# EAGLE design riser-1u-cc2420 (EAGLE 5.09)
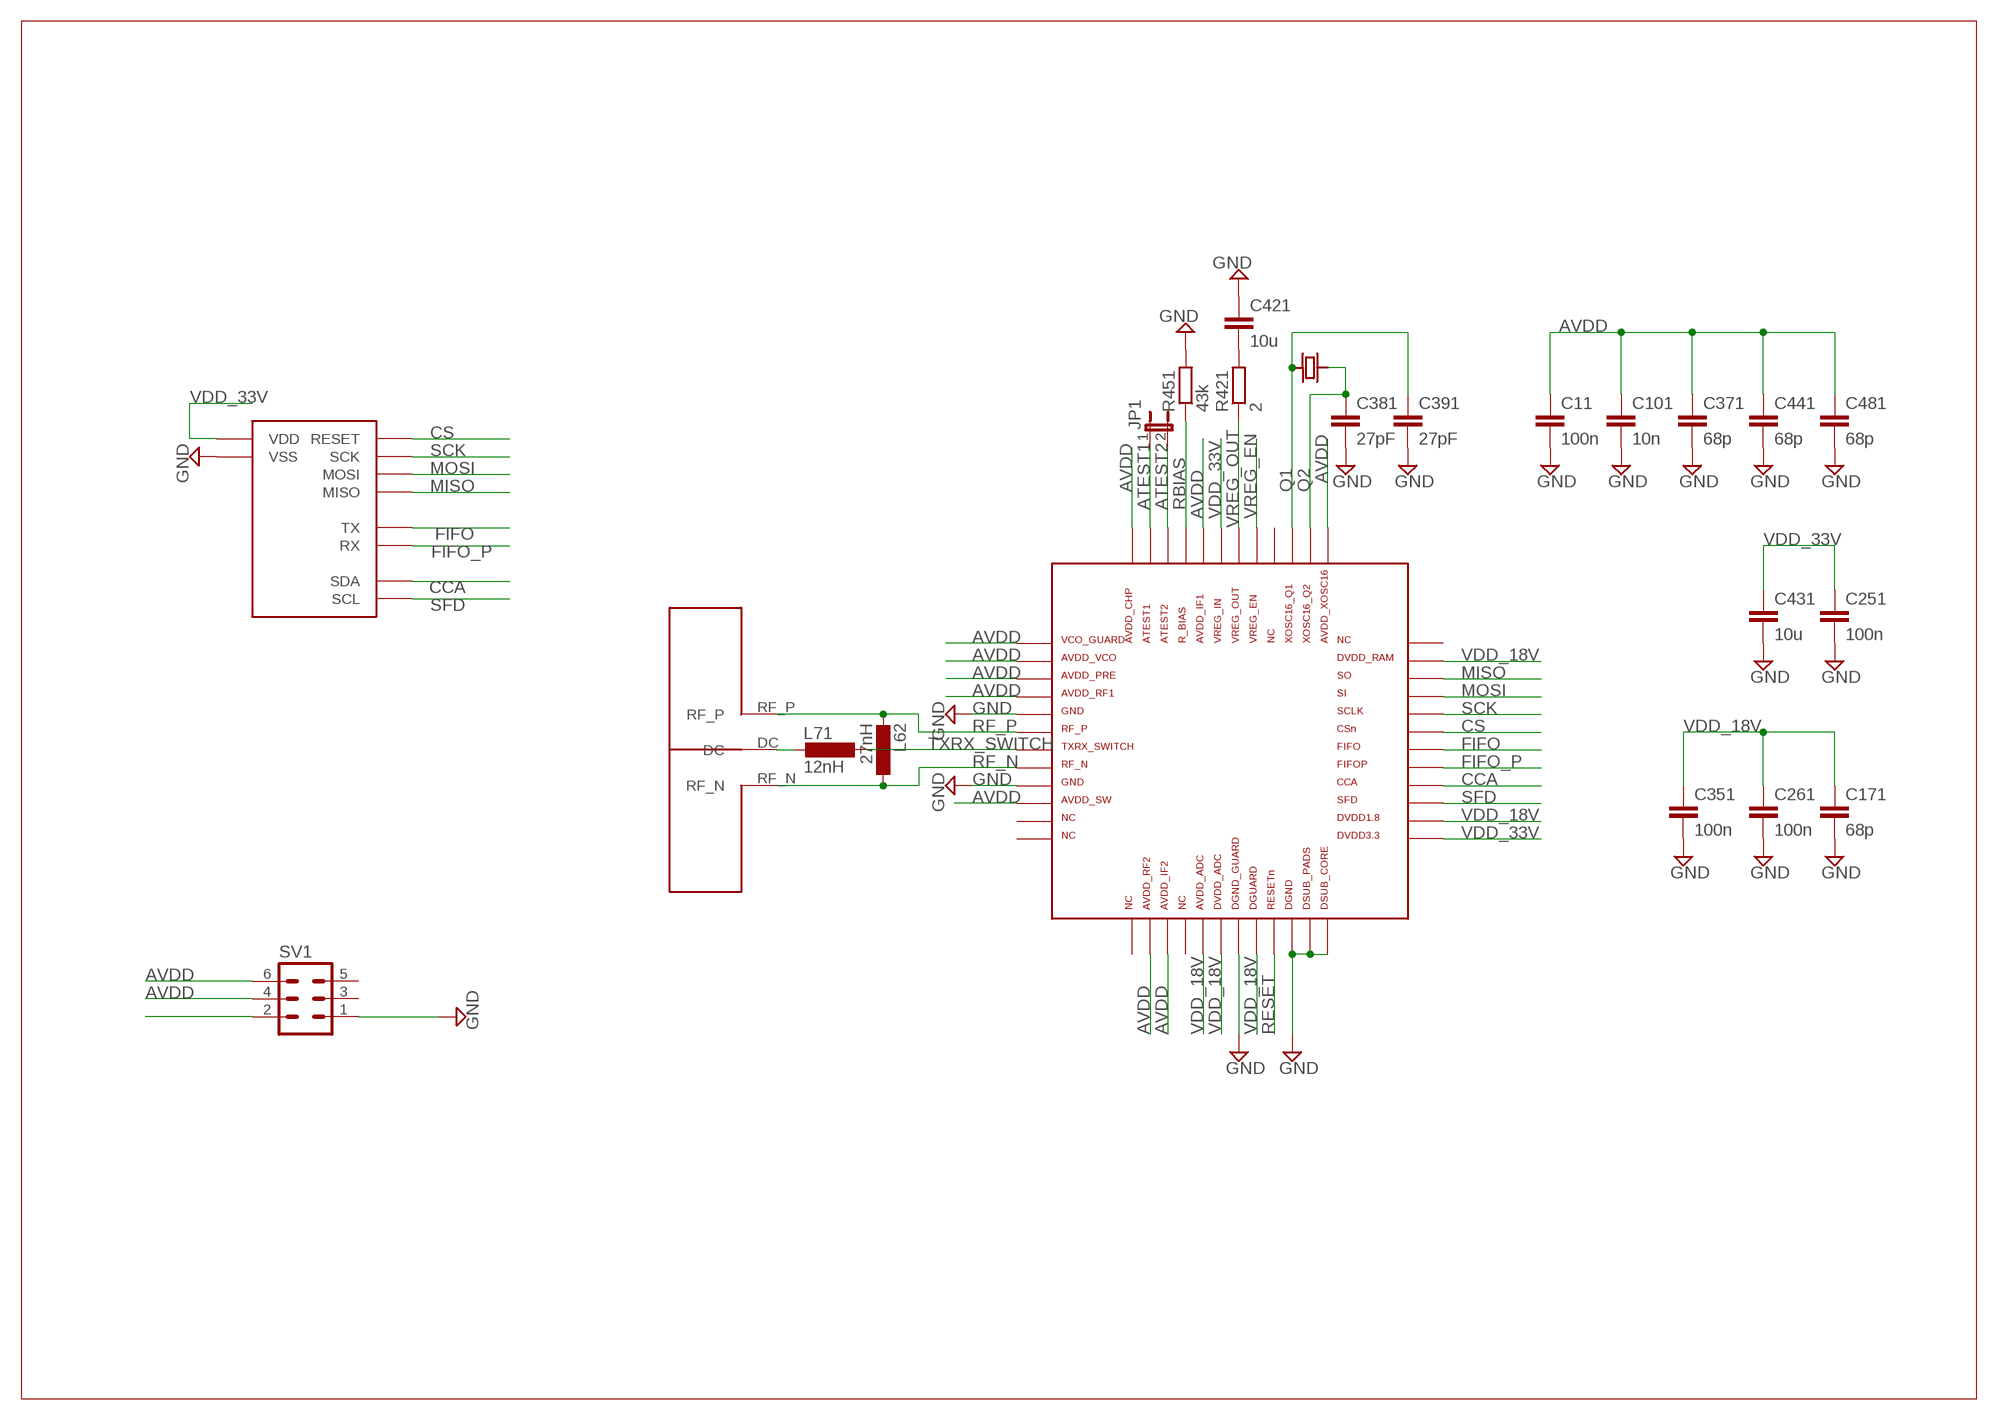
[diagram p0: schematic, sheet 1]

## Parts
C11  100n  C-EUC0402  [C0402]
C101  10n  C-EUC0402  [C0402]
C171  68p  C-EUC0402  [C0402]
C251  100n  C-EUC0402  [C0402]
C261  100n  C-EUC0402  [C0402]
C351  100n  C-EUC0402  [C0402]
C371  68p  C-EUC0402  [C0402]
C381  27pF  C-EUC0402  [C0402]
C391  27pF  C-EUC0402  [C0402]
C421  10u  C-EUC0805  [C0805]
C431  10u  C-EUC0805  [C0805]
C441  68p  C-EUC0402  [C0402]
C481  68p  C-EUC0402  [C0402]
JP1  JP1E  [JP1]
L62  27nH  L-EUL0402  [L0402]
L71  12nH  L-EUL0402  [L0402]
R421  2  R-EU_R0603  [R0603]
R451  43k  R-EU_R0402  [R0402]
SV1  MA03-2  [MA03-2]
U$1  UNI_BOARD_CONNECTOR_10  [UNI_BOARD_CONN_10]
U$2  CC2420  [QLP48]
U$3  FOLDED_DIPOLEPCB  [FOLDED_DIPOLE]
U$4  SMD_CRYSTAL_32_25  [SMD_CRYSTAL_32_25]

## Nets
ATEST1: JP1.1 U$2.47
ATEST2: JP1.2 U$2.46
AVDD: C11.1 C101.1 C371.1 C441.1 C481.1 SV1.4 SV1.6 U$2.1 U$2.2 U$2.3 U$2.4 U$2.10 U$2.14 U$2.15 U$2.37 U$2.44 U$2.48
CCA: U$1.C$8(SDA) U$2.28
CS: U$1.C$5(RESET) U$2.31
FIFO: U$1.C$7(TX) U$2.30
FIFO_P: U$1.C$9(RX) U$2.29
GND: C11.2 C101.2 C171.2 C251.2 C261.2 C351.2 C371.2 C381.2 C391.2 C421.1 C431.2 C441.2 C481.2 R451.2 SV1.1 U$1.C$6(VSS) U$2.5 U$2.9 U$2.19 U$2.22 U$2.23 U$2.24
MISO: U$1.C$1(MISO) U$2.34
MOSI: U$1.C$4(MOSI) U$2.33
N$1: C421.2 R421.2
N$3: L71.2 U$3.DC
Q1: C391.1 U$2.39 U$4.P1(X1)
Q2: C381.1 U$2.38 U$4.P3(X2)
RBIAS: R451.1 U$2.45
RESET: U$2.21
RF_N: L62.1 U$2.8 U$3.RF_N
RF_P: L62.2 U$2.6 U$3.RF_P
SCK: U$1.C$3(SCK) U$2.32
SFD: U$1.C$10(SCL) U$2.27
TXRX_SWITCH: L71.1 U$2.7
VDD_18V: C171.1 C261.1 C351.1 U$2.17 U$2.18 U$2.20 U$2.26 U$2.35
VDD_33V: C251.1 C431.1 SV1.2 U$1.C$2(VDD) U$2.25 U$2.43
VREG_EN: U$2.41
VREG_OUT: R421.1 U$2.42
Unconnected: SV1.3 SV1.5 U$2.11 U$2.12 U$2.13 U$2.16 U$2.36 U$2.40

## Library data of the parts
C11 C101 C171 C251 C261 C351 C371 C381 C391 C421 C431 C441 C481 = rcl:C-EU: CAPACITOR, European symbol
JP1 = jumper:JP1E: JUMPER
L62 L71 = my-rcl:L-EU: INDUCTOR, European symbol
R421 R451 = rcl:R-EU_: RESISTOR, European symbol
SV1 = con-lstb:MA03-2: PIN HEADER
U$1 = my-uni-board-conn:UNI_BOARD_CONNECTOR_10
U$2 = my-chipcon:CC2420
U$3 = my-chipcon:FOLDED_DIPOLE
U$4 = my-chipcon:SMD_CRYSTAL_32_25

## Board
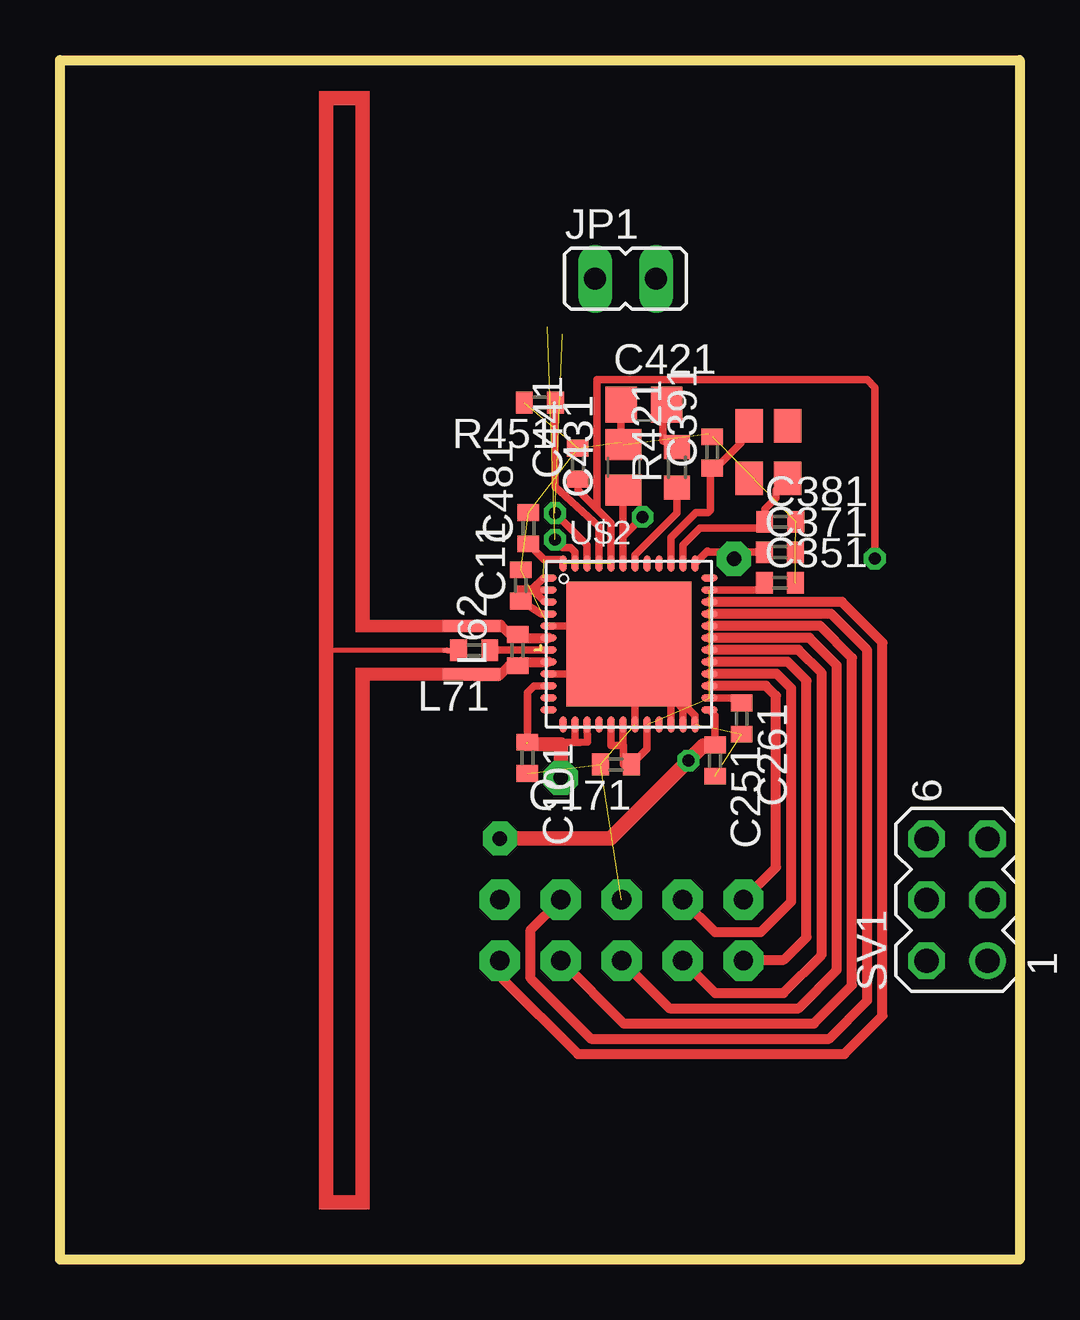
[diagram p1: board, top side]
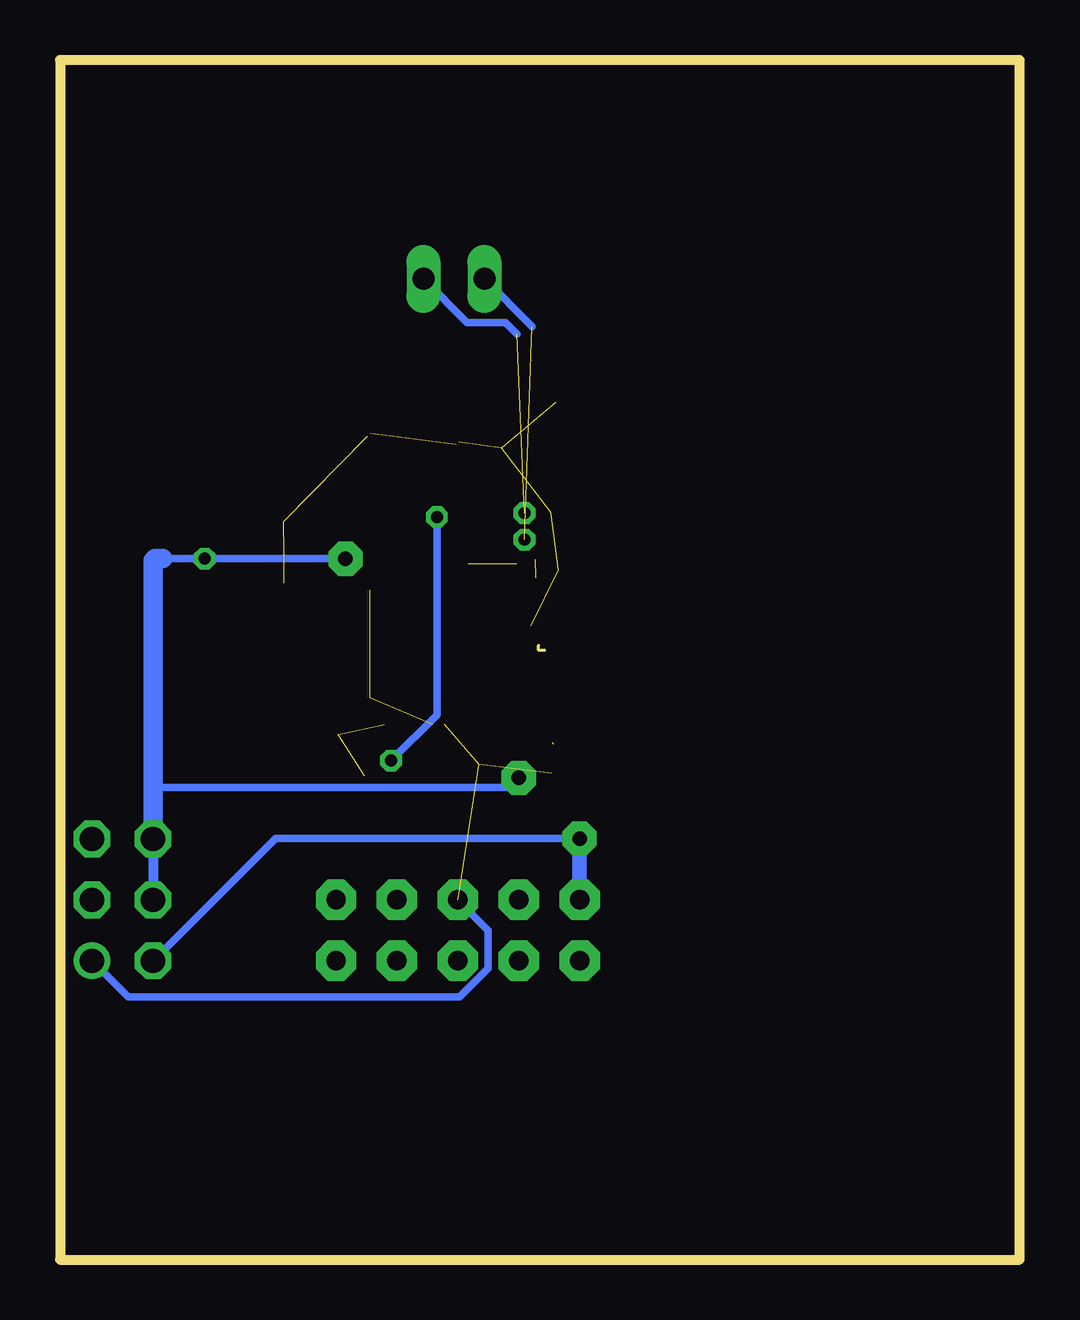
[diagram p2: board, bottom side, seen from below]

Size 40 x 50 mm. Coordinates in mm from the lower left corner, seen from the top.
Outline: 0,0 0,50 40,50 40,0 0,0
Copper layers (1*16): Top 0.035mm / dielectric 1.5mm / Bottom 0.035mm
Design rules "default": minimum track width 10mil, minimum drill 24mil, track to track 8mil, track to pad 8mil, pad to pad 8mil, via to via 8mil, smd to smd 8mil, copper to edge 40mil, drill to drill 8mil, minimum pad ring 10mil, minimum via ring 8mil, stop-mask expansion 4mil, vias tented up to drill 0mil, thermal gap 10mil

### Footprints (pad centres in the part's own frame; a part is rotated, then mirrored left to right if it is on the bottom)
C0402 = smd 0.7 x 0.9: 1 -0.65,0; 2 0.65,0
C0805 = smd 1.3 x 1.5: 1 -0.95,0; 2 0.95,0
JP1 = drill 0.914 long: 1 0,-1.27; 2 0,1.27
L0402 = smd 0.7 x 0.9: 1 -0.65,0; 2 0.65,0
R0603 = smd 1 x 1.1: 1 -0.85,0; 2 0.85,0
R0402 = smd 0.7 x 0.9: 1 -0.65,0; 2 0.65,0
MA03-2 = drill 1.016 round: 1 -2.54,-1.27 | drill 1.016 octagon: 2 -2.54,1.27; 3 0,-1.27; 4 0,1.27; 5 2.54,-1.27; 6 2.54,1.27
UNI_BOARD_CONN_10 = drill 0.8 pad 1.676 octagon: C$1 6.35,1.27; C$2 6.35,-1.27; C$3 3.81,1.27; C$4 3.81,-1.27; C$5 1.27,1.27; C$6 1.27,-1.27; C$7 -1.27,1.27; C$8 -1.27,-1.27; C$9 -3.81,1.27; C$10 -3.81,-1.27
QLP48 = smd 0.7 x 0.3: 1 -3.35,2.75; 2 -3.35,2.25; 3 -3.35,1.75; 4 -3.35,1.25; 5 -3.35,0.75; 6 -3.35,0.25; 7 -3.35,-0.25; 8 -3.35,-0.75; 9 -3.35,-1.25; 10 -3.35,-1.75; 11 -3.35,-2.25; 12 -3.35,-2.75; 25 3.35,-2.75; 26 3.35,-2.25; 27 3.35,-1.75; 28 3.35,-1.25; 29 3.35,-0.75; 30 3.35,-0.25; 31 3.35,0.25; 32 3.35,0.75; 33 3.35,1.25; 34 3.35,1.75; 35 3.35,2.25; 36 3.35,2.75 | smd 0.3 x 0.7: 13 -2.75,-3.35; 14 -2.25,-3.35; 15 -1.75,-3.35; 16 -1.25,-3.35; 17 -0.75,-3.35; 18 -0.25,-3.35; 19 0.25,-3.35; 20 0.75,-3.35; 21 1.25,-3.35; 22 1.75,-3.35; 23 2.25,-3.35; 24 2.75,-3.35; 37 2.75,3.35; 38 2.25,3.35; 39 1.75,3.35; 40 1.25,3.35; 41 0.75,3.35; 42 0.25,3.35; 43 -0.25,3.35; 44 -0.75,3.35; 45 -1.25,3.35; 46 -1.75,3.35; 47 -2.25,3.35; 48 -2.75,3.35 | smd 5.2 x 5.2: TP 0,0
FOLDED_DIPOLE = smd 0.3 x 0.2: DC 5.32,0 | smd 2.4 x 0.51: RF_N 6.375,-1.005; RF_P 6.37,1.005
SMD_CRYSTAL_32_25 = smd 1.4 x 1.15: P1 -1.1,-0.8; P2 1.1,-0.8; P3 1.1,0.8; P4 -1.1,0.8

### Placement (x,y rotation side)
C11  19.21,28.1 90 top
C101  19.48,20.91 270 top
C171  23.18,20.64 180 top
C251  27.31,20.8 270 top
C261  28.42,22.54 270 top
C351  30.01,28.2 0 top
C371  30.01,29.48 0 top
C381  30.03,30.75 0 top
C391  27.19,33.64 90 top
C421  24.34,35.63 0 top
C431  23.5,33.02 90 top
C441  21.59,33.18 90 top
C481  19.53,30.48 90 top
JP1  23.58,40.88 270 top
L62  19.07,25.4 90 top
L71  17.27,25.4 180 top
R421  25.72,33.02 90 top
R451  20,35.72 180 top
SV1  37.39,14.99 90 top
U$1  24.68,13.73 180 top
U$2  23.72,25.66 0 top
U$3  10.79,25.4 0 top
U$4  29.53,33.66 270 top

### Tracks (layer width: path | path; a pad name or v marks a point on that pad's centre or on a via)
ATEST1  (via drill 0.5 pad 0.18)  (1 unrouted)
  Top 0.305: U$2.47 21.47,29.49 21.27,29.69 20.95,29.69 v20.64,30
  Bottom 0.305: 20.32,38.89 JP1.1
ATEST2  (via drill 0.5 pad 0.18)  (1 unrouted)
  Top 0.305: U$2.46 21.97,29.78 v20.64,31.11
  Bottom 0.305: 20.95,38.58 21.43,39.05 23.02,39.05 JP1.2
AVDD  (via drill 0.5 pad 0.18, 0.6 pad 1.42)  (3 unrouted)
  Top 0.305: U$2.1 20.15,28.41 19.68,27.94 | 19.68,27.94 19.07,27.94 C11.1 | U$2.2 19.07,27.91 C11.1 | U$2.3 20.22,27.41 19.68,27.94 | U$2.4 20.07,26.91 C11.1 | U$2.48 20.97,29.18 20.18,29.18 C481.1 | U$2.10 19.77,23.91 19.49,23.63 19.49,21.89 C101.1 | U$2.15 21.98,21.57 21.68,21.56 21.05,21.56 | 19.43,21.48 21.05,21.56 | U$2.14 21.47,21.56 21.05,21.56 | C371.1 28.1,29.48 26.95,29.48 U$2.37 26.99,29.53 | U$2.44 22.97,30.69 22.38,31.27 | 22.38,31.27 22.38,36.67 33.66,36.67 33.97,36.35 v33.97,29.21 | C441.1 21.59,32.07 22.38,31.27 | 22.38,31.27
  Top 0.406: v28.1,29.21 28.1,29.48
  Top 0.61: v20.88,20.08 20.89,21.47 19.43,21.48
  Bottom 0.305: v28.1,29.21 v33.97,29.21 35.72,29.21 | v20.88,20.08 21.27,19.68 36.12,19.68
  Bottom 0.406: SV1.6 SV1.4
  Bottom 0.61: v20.88,20.08 20.95,20.16
  Bottom 0.813: SV1.6 36.12,19.68 36.12,29.13 36.04,29.21 35.72,29.21
CCA
  Top 0.406: U$2.28 29.89,24.41 30.48,23.81 30.48,14.92 29.21,13.65 27.3,13.65 U$1.C$8
CS
  Top 0.406: U$2.31 31.24,25.91 32.38,24.77 32.38,12.06 30.8,10.48 25.4,10.48 U$1.C$5
FIFO
  Top 0.406: U$2.30 30.79,25.41 31.75,24.45 31.75,12.7 30.16,11.11 27.3,11.11 U$1.C$7
FIFO_P
  Top 0.406: U$2.29 30.34,24.91 31.11,24.13 31.11,13.44 30.17,12.49 28.52,12.49 U$1.C$9
GND  (14 unrouted)
  Top 0.305: 21.6,24.41 23.97,24.41 23.97,23.19 | 21.6,24.41 U$2.9 | U$2.19 23.97,23.19 | U$2.24 26.47,22.68 25.94,23.21 25.72,23.21 | 25.4,23.21 23.99,23.21 23.97,23.19 | 25.4,23.21 25.72,23.21 | U$2.23 25.97,22.96 25.72,23.21 | U$2.22 25.47,23.14 25.4,23.21 | U$2.5 21.22,26.41 21.27,26.35 21.27,24.73 21.6,24.41 | C391.2 27.05,34.44 | C431.2 23.39,34.07 C421.1
  Bottom 0.305: SV1.1 37.16,10.95 23.34,10.95 22.16,12.13 22.16,13.72 23.41,14.97 U$1.C$6
MISO
  Top 0.406: U$2.34 32.6,27.41 34.29,25.72 34.29,10.16 32.7,8.57 21.59,8.57 18.41,11.75 18.41,12.38 U$1.C$1
MOSI
  Top 0.406: U$2.33 32.15,26.91 33.66,25.4 33.66,10.79 32.07,9.21 22.13,9.21 19.62,11.72 19.62,13.74 U$1.C$4
N$1
  Top 0.305: R421.2 25.14,34.12 25.14,35.48 C421.2
N$3
  Top 0.254: 16.74,25.39 U$3.DC
  Top 0.305: L71.2 16.74,25.4 16.74,25.39
Q1
  Top 0.305: U$2.39 25.47,30.09 26.51,31.13 27,31.13 27.12,31.25 27.12,32.92 C391.1 27.34,32.99 28.39,34.04 28.39,34.42 U$4.P1
Q2
  Top 0.305: U$2.38 25.97,29.78 26.67,30.48 29.1,30.48 C381.1 29.38,31.28 29.84,31.75 29.84,32.07 U$4.P3
RBIAS
  Top 0.305: U$2.45 22.47,30.55 20.64,32.23 20.64,35.39 R451.1
RF_N
  Top 0.406: U$2.8 19.23,24.91 L62.1 18.75,24.75 18.73,24.77 18.73,24.76 18.3,24.33 17.23,24.33 U$3.RF_N
RF_P
  Top 0.406: U$2.6 19.22,25.91 L62.2 18.77,26.05 18.37,26.45 17.21,26.45 U$3.RF_P
SCK
  Top 0.406: U$2.32 31.7,26.41 33.02,25.08 33.02,11.43 31.43,9.84 23.49,9.84 U$1.C$3
SFD
  Top 0.406: U$2.27 29.43,23.91 29.84,23.5 29.84,16.35 U$1.C$10
TXRX_SWITCH
  Top 0.305: U$2.7 L71.1
VDD_18V  (2 unrouted)
  Top 0.305: U$2.17 22.97,21.43 23.47,21.43 | 23.47,21.43 U$2.18 | 23.47,21.43 23.5,21.43 23.5,20.64 C171.1 24.47,21.28 U$2.20 | U$2.35 29.06,27.91 C351.1 | U$2.26 28.2,23.41 C261.1
VDD_33V  (via drill 0.5 pad 0.81, 0.6 pad 1.42)
  Top 0.305: C431.1 23.47,32.05 U$2.43 23.47,30.14 v24.29,30.96 | U$2.25 27.3,22.67 C251.1
  Top 0.61: C251.1 27.29,21.43 26.83,21.43 v26.19,20.8 22.95,17.55 v18.34,17.55
  Bottom 0.305: v24.29,30.96 24.29,22.7 v26.19,20.8 | SV1.2 31.02,17.55 v18.34,17.55
  Bottom 0.61: U$1.C$2 v18.34,17.55
VREG_OUT
  Top 0.305: U$2.42 23.97,29.37 25.72,31.11 R421.1

### Text on the board
tOrigins: VDD | MOSI | VSS | SDA | SCL | TX | RX | MISO | SCK | RESET | RX